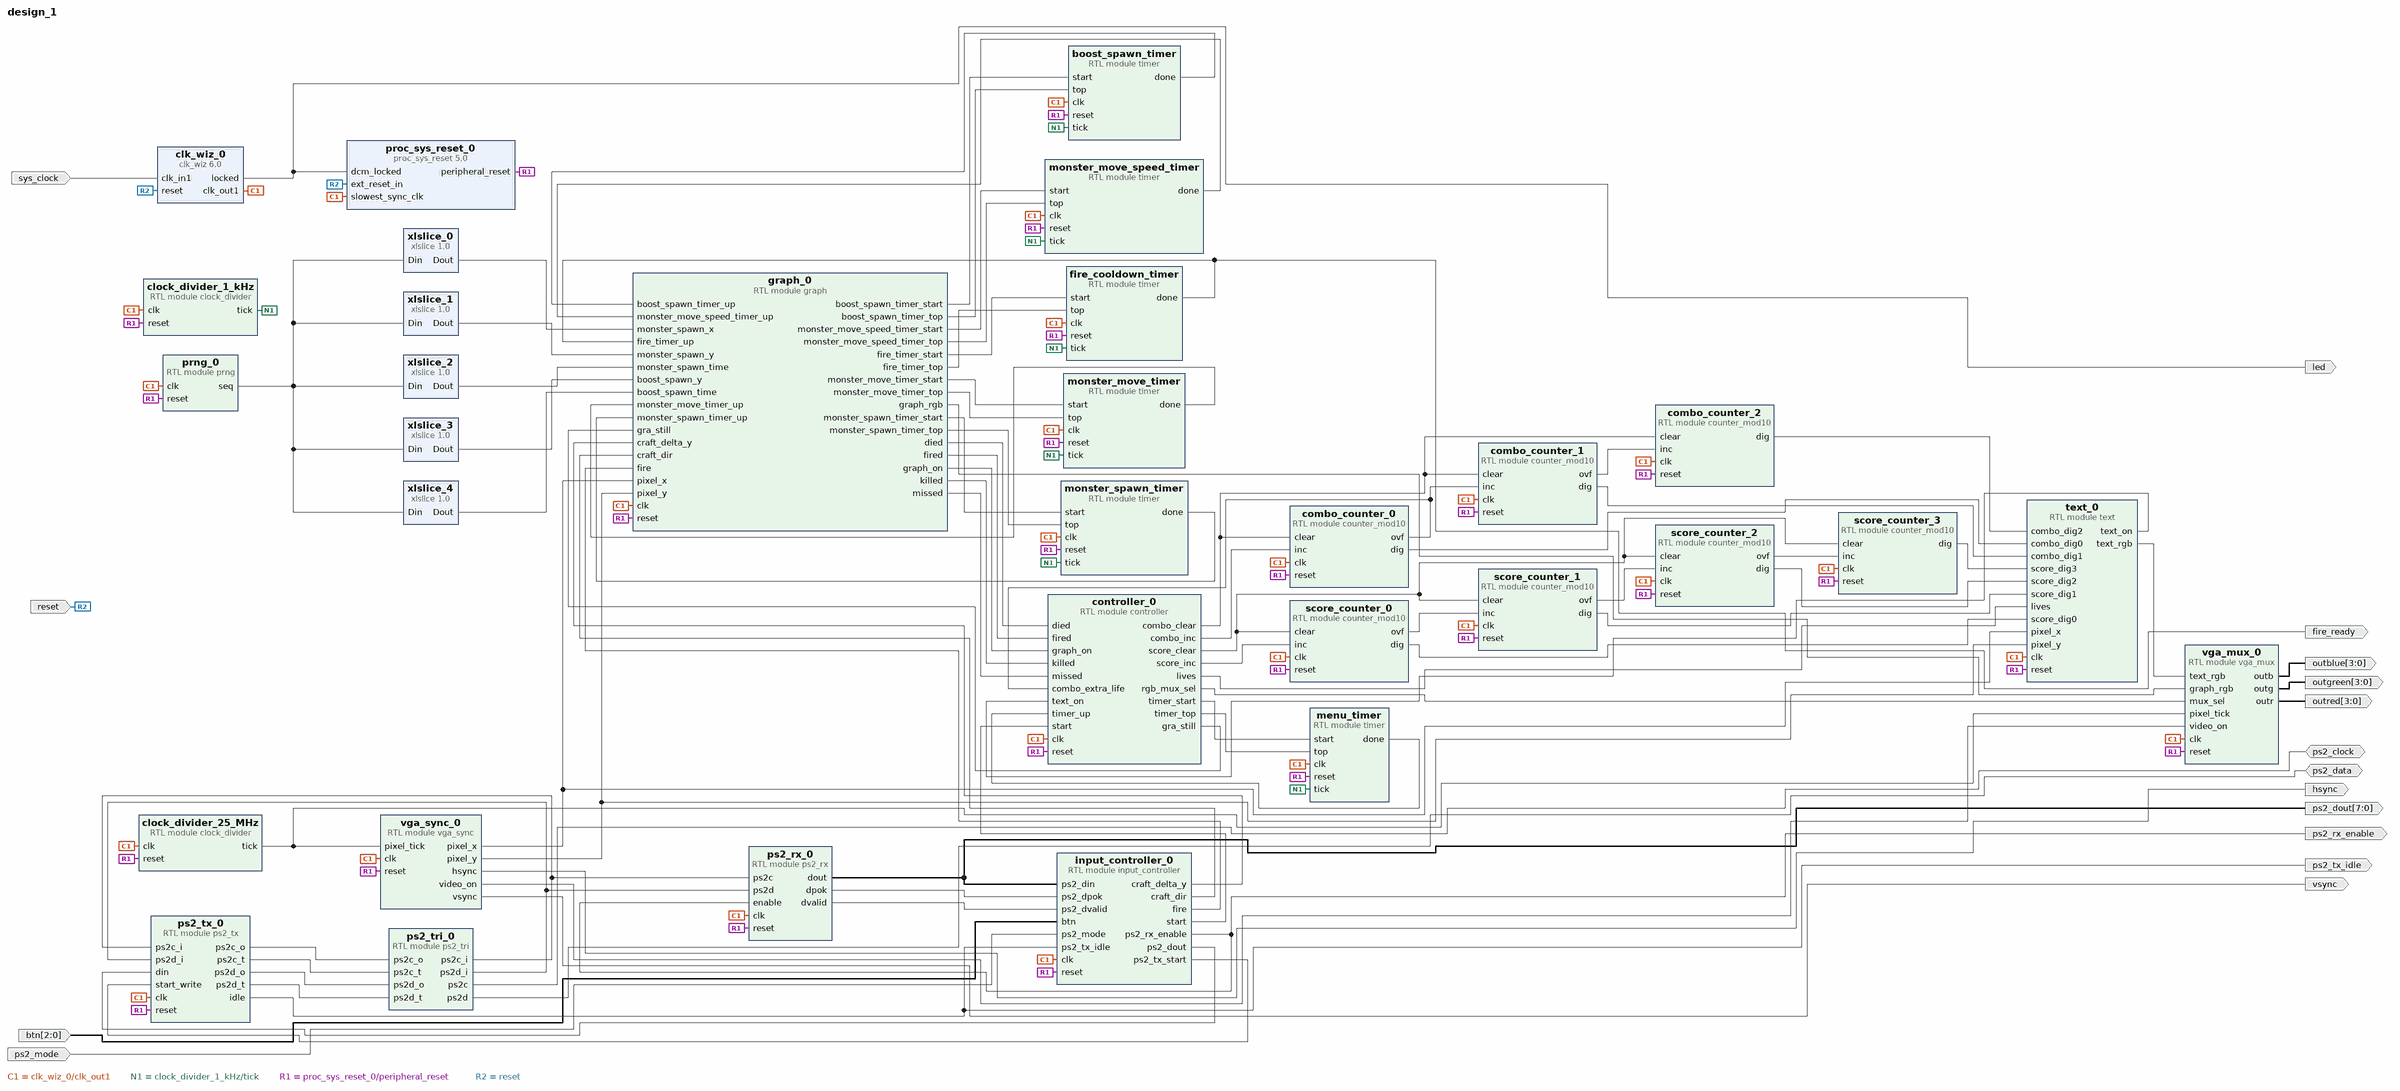
[diagram p0: block diagram of the top level]
# Vivado block design design_1, xc7a35tcpg236-1, Vivado 2021.1
create_bd_design design_1

create_bd_port -dir I -type clk sys_clock
set_property -dict {CONFIG.FREQ_HZ 100000000 CONFIG.PHASE 0.0} [get_bd_ports sys_clock]
create_bd_port -dir I -type rst reset
set_property -dict {CONFIG.POLARITY ACTIVE_HIGH} [get_bd_ports reset]
create_bd_port -dir O hsync
create_bd_port -dir O vsync
create_bd_port -dir I -from 2 -to 0 btn
create_bd_port -dir O led
create_bd_port -dir O -from 3 -to 0 outred
create_bd_port -dir O -from 3 -to 0 outgreen
create_bd_port -dir O -from 3 -to 0 outblue
create_bd_port -dir O fire_ready
create_bd_port -dir I ps2_mode
create_bd_port -dir O -from 7 -to 0 ps2_dout
create_bd_port -dir O ps2_rx_enable
create_bd_port -dir IO ps2_clock
create_bd_port -dir IO ps2_data
create_bd_port -dir O ps2_tx_idle

create_bd_cell -type ip -vlnv xilinx.com:ip:clk_wiz:6.0 clk_wiz_0
set_property -dict [list \
  CONFIG.CLKOUT1_JITTER 151.636 \
  CONFIG.CLKOUT1_REQUESTED_OUT_FREQ 50 \
  CONFIG.CLK_IN1_BOARD_INTERFACE sys_clock \
  CONFIG.MMCM_CLKOUT0_DIVIDE_F 20.000 \
  CONFIG.RESET_BOARD_INTERFACE reset \
  CONFIG.USE_BOARD_FLOW true \
] [get_bd_cells clk_wiz_0]
create_bd_cell -type ip -vlnv xilinx.com:ip:proc_sys_reset:5.0 proc_sys_reset_0
create_bd_cell -type module -reference vga_sync vga_sync_0
create_bd_cell -type module -reference timer menu_timer
create_bd_cell -type module -reference counter_mod10 score_counter_0
create_bd_cell -type module -reference counter_mod10 score_counter_1
create_bd_cell -type module -reference counter_mod10 score_counter_2
create_bd_cell -type module -reference counter_mod10 score_counter_3
create_bd_cell -type module -reference clock_divider clock_divider_1_kHz
set_property -dict {CONFIG.DIV 50000} [get_bd_cells clock_divider_1_kHz]
create_bd_cell -type module -reference clock_divider clock_divider_25_MHz
set_property -dict {CONFIG.DIV 2} [get_bd_cells clock_divider_25_MHz]
create_bd_cell -type module -reference timer fire_cooldown_timer
create_bd_cell -type ip -vlnv xilinx.com:ip:xlslice:1.0 xlslice_0
set_property -dict {CONFIG.DIN_FROM 63 CONFIG.DIN_TO 54 CONFIG.DIN_WIDTH 64 CONFIG.DOUT_WIDTH 10} [get_bd_cells xlslice_0]
create_bd_cell -type ip -vlnv xilinx.com:ip:xlslice:1.0 xlslice_1
set_property -dict {CONFIG.DIN_FROM 53 CONFIG.DIN_TO 44 CONFIG.DIN_WIDTH 64 CONFIG.DOUT_WIDTH 10} [get_bd_cells xlslice_1]
create_bd_cell -type ip -vlnv xilinx.com:ip:xlslice:1.0 xlslice_2
set_property -dict {CONFIG.DIN_FROM 11 CONFIG.DIN_TO 0 CONFIG.DIN_WIDTH 64 CONFIG.DOUT_WIDTH 12} [get_bd_cells xlslice_2]
create_bd_cell -type module -reference timer monster_spawn_timer
create_bd_cell -type module -reference timer monster_move_timer
create_bd_cell -type module -reference counter_mod10 combo_counter_0
create_bd_cell -type module -reference counter_mod10 combo_counter_1
create_bd_cell -type module -reference counter_mod10 combo_counter_2
create_bd_cell -type module -reference prng prng_0
create_bd_cell -type module -reference vga_mux vga_mux_0
create_bd_cell -type module -reference controller controller_0
create_bd_cell -type module -reference text text_0
create_bd_cell -type module -reference ps2_rx ps2_rx_0
create_bd_cell -type module -reference timer boost_spawn_timer
create_bd_cell -type module -reference timer monster_move_speed_timer
create_bd_cell -type ip -vlnv xilinx.com:ip:xlslice:1.0 xlslice_3
set_property -dict {CONFIG.DIN_FROM 43 CONFIG.DIN_TO 34 CONFIG.DIN_WIDTH 64 CONFIG.DOUT_WIDTH 10} [get_bd_cells xlslice_3]
create_bd_cell -type ip -vlnv xilinx.com:ip:xlslice:1.0 xlslice_4
set_property -dict {CONFIG.DIN_FROM 23 CONFIG.DIN_TO 12 CONFIG.DIN_WIDTH 64 CONFIG.DOUT_WIDTH 12} [get_bd_cells xlslice_4]
create_bd_cell -type module -reference graph graph_0
create_bd_cell -type module -reference ps2_tri ps2_tri_0
create_bd_cell -type module -reference ps2_tx ps2_tx_0
create_bd_cell -type module -reference input_controller input_controller_0

# ---- connections ----

connect_bd_net [get_bd_pins controller_0/score_clear] \
  [get_bd_pins score_counter_0/clear] [get_bd_pins score_counter_1/clear] [get_bd_pins score_counter_2/clear] \
  [get_bd_pins score_counter_3/clear]
connect_bd_net [get_bd_pins controller_0/combo_clear] \
  [get_bd_pins combo_counter_1/clear] [get_bd_pins combo_counter_0/clear] [get_bd_pins combo_counter_2/clear]
connect_bd_net [get_bd_ports ps2_clock] [get_bd_pins ps2_tri_0/ps2c]
connect_bd_net [get_bd_ports ps2_data] [get_bd_pins ps2_tri_0/ps2d]
connect_bd_net [get_bd_pins ps2_tri_0/ps2c_i] [get_bd_pins ps2_rx_0/ps2c] [get_bd_pins ps2_tx_0/ps2c_i]
connect_bd_net [get_bd_pins ps2_tri_0/ps2d_i] [get_bd_pins ps2_rx_0/ps2d] [get_bd_pins ps2_tx_0/ps2d_i]
connect_bd_net [get_bd_pins boost_spawn_timer/done] [get_bd_pins graph_0/boost_spawn_timer_up]
connect_bd_net [get_bd_ports btn] [get_bd_pins input_controller_0/btn]
connect_bd_net [get_bd_pins clk_wiz_0/clk_out1] \
  [get_bd_pins proc_sys_reset_0/slowest_sync_clk] [get_bd_pins vga_sync_0/clk] [get_bd_pins menu_timer/clk] \
  [get_bd_pins score_counter_0/clk] [get_bd_pins score_counter_1/clk] [get_bd_pins score_counter_2/clk] \
  [get_bd_pins score_counter_3/clk] [get_bd_pins clock_divider_1_kHz/clk] [get_bd_pins clock_divider_25_MHz/clk] \
  [get_bd_pins fire_cooldown_timer/clk] [get_bd_pins monster_spawn_timer/clk] [get_bd_pins monster_move_timer/clk] \
  [get_bd_pins combo_counter_1/clk] [get_bd_pins combo_counter_0/clk] [get_bd_pins combo_counter_2/clk] \
  [get_bd_pins prng_0/clk] [get_bd_pins vga_mux_0/clk] [get_bd_pins controller_0/clk] [get_bd_pins text_0/clk] \
  [get_bd_pins ps2_rx_0/clk] [get_bd_pins monster_move_speed_timer/clk] [get_bd_pins boost_spawn_timer/clk] \
  [get_bd_pins graph_0/clk] [get_bd_pins ps2_tx_0/clk] [get_bd_pins input_controller_0/clk]
connect_bd_net [get_bd_pins clk_wiz_0/locked] [get_bd_ports led] [get_bd_pins proc_sys_reset_0/dcm_locked]
connect_bd_net -net clock_divider_0_tick [get_bd_pins clock_divider_1_kHz/tick] \
  [get_bd_pins menu_timer/tick] [get_bd_pins fire_cooldown_timer/tick] [get_bd_pins monster_spawn_timer/tick] \
  [get_bd_pins monster_move_timer/tick] [get_bd_pins monster_move_speed_timer/tick] [get_bd_pins boost_spawn_timer/tick]
connect_bd_net [get_bd_pins clock_divider_25_MHz/tick] [get_bd_pins vga_sync_0/pixel_tick] [get_bd_pins vga_mux_0/pixel_tick]
connect_bd_net [get_bd_pins combo_counter_0/dig] [get_bd_pins text_0/combo_dig0]
connect_bd_net [get_bd_pins combo_counter_0/ovf] [get_bd_pins combo_counter_1/inc] [get_bd_pins controller_0/combo_extra_life]
connect_bd_net [get_bd_pins combo_counter_1/dig] [get_bd_pins text_0/combo_dig1]
connect_bd_net [get_bd_pins combo_counter_1/ovf] [get_bd_pins combo_counter_2/inc]
connect_bd_net [get_bd_pins combo_counter_2/dig] [get_bd_pins text_0/combo_dig2]
connect_bd_net [get_bd_pins controller_0/combo_inc] [get_bd_pins combo_counter_0/inc]
connect_bd_net [get_bd_pins controller_0/gra_still] [get_bd_pins graph_0/gra_still]
connect_bd_net [get_bd_pins controller_0/lives] [get_bd_pins text_0/lives]
connect_bd_net [get_bd_pins controller_0/rgb_mux_sel] [get_bd_pins vga_mux_0/mux_sel]
connect_bd_net [get_bd_pins controller_0/score_inc] [get_bd_pins score_counter_0/inc]
connect_bd_net [get_bd_pins controller_0/timer_start] [get_bd_pins menu_timer/start]
connect_bd_net [get_bd_pins controller_0/timer_top] [get_bd_pins menu_timer/top]
connect_bd_net -net counter_mod10_0_dig [get_bd_pins score_counter_0/dig] [get_bd_pins text_0/score_dig0]
connect_bd_net -net counter_mod10_0_ovf [get_bd_pins score_counter_0/ovf] [get_bd_pins score_counter_1/inc]
connect_bd_net -net counter_mod10_1_dig [get_bd_pins score_counter_1/dig] [get_bd_pins text_0/score_dig1]
connect_bd_net -net counter_mod10_1_ovf [get_bd_pins score_counter_1/ovf] [get_bd_pins score_counter_2/inc]
connect_bd_net -net counter_mod10_2_dig [get_bd_pins score_counter_2/dig] [get_bd_pins text_0/score_dig2]
connect_bd_net -net counter_mod10_2_ovf [get_bd_pins score_counter_2/ovf] [get_bd_pins score_counter_3/inc]
connect_bd_net -net counter_mod10_3_dig [get_bd_pins score_counter_3/dig] [get_bd_pins text_0/score_dig3]
connect_bd_net [get_bd_pins graph_0/boost_spawn_timer_start] [get_bd_pins boost_spawn_timer/start]
connect_bd_net [get_bd_pins graph_0/boost_spawn_timer_top] [get_bd_pins boost_spawn_timer/top]
connect_bd_net [get_bd_pins graph_0/died] [get_bd_pins controller_0/died]
connect_bd_net [get_bd_pins graph_0/fire_timer_start] [get_bd_pins fire_cooldown_timer/start]
connect_bd_net [get_bd_pins graph_0/fire_timer_top] [get_bd_pins fire_cooldown_timer/top]
connect_bd_net [get_bd_pins graph_0/fired] [get_bd_pins controller_0/fired]
connect_bd_net [get_bd_pins graph_0/graph_on] [get_bd_pins controller_0/graph_on]
connect_bd_net [get_bd_pins graph_0/graph_rgb] [get_bd_pins vga_mux_0/graph_rgb]
connect_bd_net [get_bd_pins graph_0/killed] [get_bd_pins controller_0/killed]
connect_bd_net [get_bd_pins graph_0/missed] [get_bd_pins controller_0/missed]
connect_bd_net [get_bd_pins graph_0/monster_move_speed_timer_start] [get_bd_pins monster_move_speed_timer/start]
connect_bd_net [get_bd_pins graph_0/monster_move_speed_timer_top] [get_bd_pins monster_move_speed_timer/top]
connect_bd_net [get_bd_pins graph_0/monster_move_timer_start] [get_bd_pins monster_move_timer/start]
connect_bd_net [get_bd_pins graph_0/monster_move_timer_top] [get_bd_pins monster_move_timer/top]
connect_bd_net [get_bd_pins graph_0/monster_spawn_timer_start] [get_bd_pins monster_spawn_timer/start]
connect_bd_net [get_bd_pins graph_0/monster_spawn_timer_top] [get_bd_pins monster_spawn_timer/top]
connect_bd_net [get_bd_pins input_controller_0/craft_delta_y] [get_bd_pins graph_0/craft_delta_y]
connect_bd_net [get_bd_pins input_controller_0/craft_dir] [get_bd_pins graph_0/craft_dir]
connect_bd_net [get_bd_pins input_controller_0/fire] [get_bd_pins graph_0/fire]
connect_bd_net [get_bd_pins input_controller_0/ps2_dout] [get_bd_pins ps2_tx_0/din]
connect_bd_net [get_bd_pins input_controller_0/ps2_rx_enable] [get_bd_pins ps2_rx_0/enable] [get_bd_ports ps2_rx_enable]
connect_bd_net [get_bd_pins input_controller_0/ps2_tx_start] [get_bd_pins ps2_tx_0/start_write]
connect_bd_net [get_bd_pins input_controller_0/start] [get_bd_pins controller_0/start]
connect_bd_net [get_bd_pins monster_move_speed_timer/done] [get_bd_pins graph_0/monster_move_speed_timer_up]
connect_bd_net [get_bd_pins monster_move_timer/done] [get_bd_pins graph_0/monster_move_timer_up]
connect_bd_net [get_bd_pins monster_spawn_timer/done] [get_bd_pins graph_0/monster_spawn_timer_up]
connect_bd_net [get_bd_pins prng_0/seq] \
  [get_bd_pins xlslice_0/Din] [get_bd_pins xlslice_1/Din] [get_bd_pins xlslice_2/Din] [get_bd_pins xlslice_4/Din] \
  [get_bd_pins xlslice_3/Din]
connect_bd_net -net proc_sys_reset_0_peripheral_aresetn [get_bd_pins proc_sys_reset_0/peripheral_reset] \
  [get_bd_pins vga_sync_0/reset] [get_bd_pins menu_timer/reset] [get_bd_pins score_counter_0/reset] \
  [get_bd_pins score_counter_1/reset] [get_bd_pins score_counter_2/reset] [get_bd_pins score_counter_3/reset] \
  [get_bd_pins clock_divider_1_kHz/reset] [get_bd_pins clock_divider_25_MHz/reset] [get_bd_pins fire_cooldown_timer/reset] \
  [get_bd_pins monster_spawn_timer/reset] [get_bd_pins monster_move_timer/reset] [get_bd_pins combo_counter_1/reset] \
  [get_bd_pins combo_counter_0/reset] [get_bd_pins combo_counter_2/reset] [get_bd_pins prng_0/reset] \
  [get_bd_pins vga_mux_0/reset] [get_bd_pins controller_0/reset] [get_bd_pins text_0/reset] [get_bd_pins ps2_rx_0/reset] \
  [get_bd_pins monster_move_speed_timer/reset] [get_bd_pins boost_spawn_timer/reset] [get_bd_pins graph_0/reset] \
  [get_bd_pins ps2_tx_0/reset] [get_bd_pins input_controller_0/reset]
connect_bd_net -net ps2_mode_0_1 [get_bd_ports ps2_mode] [get_bd_pins input_controller_0/ps2_mode]
connect_bd_net [get_bd_pins ps2_rx_0/dout] [get_bd_ports ps2_dout] [get_bd_pins input_controller_0/ps2_din]
connect_bd_net [get_bd_pins ps2_rx_0/dpok] [get_bd_pins input_controller_0/ps2_dpok]
connect_bd_net [get_bd_pins ps2_rx_0/dvalid] [get_bd_pins input_controller_0/ps2_dvalid]
connect_bd_net [get_bd_pins ps2_tx_0/idle] [get_bd_ports ps2_tx_idle] [get_bd_pins input_controller_0/ps2_tx_idle]
connect_bd_net [get_bd_pins ps2_tx_0/ps2c_o] [get_bd_pins ps2_tri_0/ps2c_o]
connect_bd_net [get_bd_pins ps2_tx_0/ps2c_t] [get_bd_pins ps2_tri_0/ps2c_t]
connect_bd_net [get_bd_pins ps2_tx_0/ps2d_o] [get_bd_pins ps2_tri_0/ps2d_o]
connect_bd_net [get_bd_pins ps2_tx_0/ps2d_t] [get_bd_pins ps2_tri_0/ps2d_t]
connect_bd_net [get_bd_ports reset] [get_bd_pins clk_wiz_0/reset] [get_bd_pins proc_sys_reset_0/ext_reset_in]
connect_bd_net [get_bd_ports sys_clock] [get_bd_pins clk_wiz_0/clk_in1]
connect_bd_net [get_bd_pins text_0/text_on] [get_bd_pins controller_0/text_on]
connect_bd_net [get_bd_pins text_0/text_rgb] [get_bd_pins vga_mux_0/text_rgb]
connect_bd_net -net timer_0_done [get_bd_pins menu_timer/done] [get_bd_pins controller_0/timer_up]
connect_bd_net -net timer_1_done [get_bd_pins fire_cooldown_timer/done] [get_bd_ports fire_ready] [get_bd_pins graph_0/fire_timer_up]
connect_bd_net [get_bd_pins vga_mux_0/outb] [get_bd_ports outblue]
connect_bd_net [get_bd_pins vga_mux_0/outg] [get_bd_ports outgreen]
connect_bd_net [get_bd_pins vga_mux_0/outr] [get_bd_ports outred]
connect_bd_net [get_bd_pins vga_sync_0/hsync] [get_bd_ports hsync]
connect_bd_net [get_bd_pins vga_sync_0/pixel_x] [get_bd_pins text_0/pixel_x] [get_bd_pins graph_0/pixel_x]
connect_bd_net [get_bd_pins vga_sync_0/pixel_y] [get_bd_pins text_0/pixel_y] [get_bd_pins graph_0/pixel_y]
connect_bd_net [get_bd_pins vga_sync_0/video_on] [get_bd_pins vga_mux_0/video_on]
connect_bd_net [get_bd_pins vga_sync_0/vsync] [get_bd_ports vsync]
connect_bd_net [get_bd_pins xlslice_0/Dout] [get_bd_pins graph_0/monster_spawn_x]
connect_bd_net [get_bd_pins xlslice_1/Dout] [get_bd_pins graph_0/monster_spawn_y]
connect_bd_net [get_bd_pins xlslice_2/Dout] [get_bd_pins graph_0/monster_spawn_time]
connect_bd_net [get_bd_pins xlslice_3/Dout] [get_bd_pins graph_0/boost_spawn_y]
connect_bd_net [get_bd_pins xlslice_4/Dout] [get_bd_pins graph_0/boost_spawn_time]

validate_bd_design
save_bd_design
